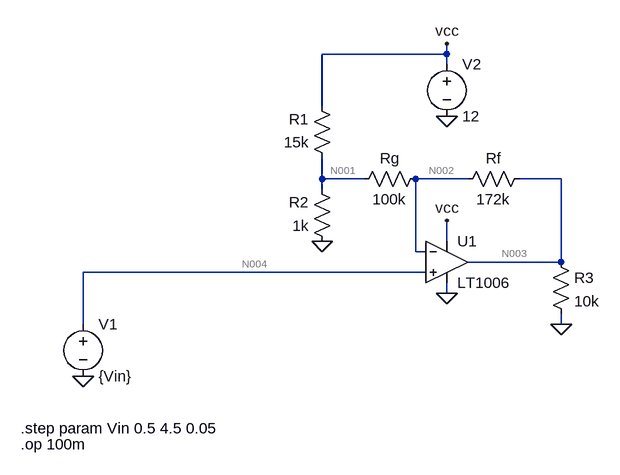
[diagram p0: schematic sim.asc]
sim.asc, the LTspice schematic file:
Version 4
SHEET 1 880 680
WIRE 592 -256 592 -272
WIRE 592 -256 400 -256
WIRE 592 -240 592 -256
WIRE 400 -176 400 -256
WIRE 400 -64 400 -96
WIRE 464 -64 400 -64
WIRE 624 -64 544 -64
WIRE 768 -64 704 -64
WIRE 400 -48 400 -64
WIRE 592 32 592 0
WIRE 544 48 544 -64
WIRE 560 48 544 48
WIRE 768 64 768 -64
WIRE 768 64 624 64
WIRE 560 80 32 80
WIRE 592 112 592 96
WIRE 32 160 32 80
WIRE 768 160 768 144
FLAG 592 -160 0
FLAG 32 240 0
FLAG 592 0 vcc
FLAG 592 112 0
FLAG 592 -272 vcc
FLAG 768 160 0
FLAG 400 32 0
SYMBOL voltage 32 144 R0
WINDOW 123 0 0 Left 2
WINDOW 39 0 0 Left 2
SYMATTR InstName V1
SYMATTR Value {Vin}
SYMBOL voltage 592 -256 R0
WINDOW 123 0 0 Left 2
WINDOW 39 0 0 Left 2
SYMATTR InstName V2
SYMATTR Value 12
SYMBOL res 720 -80 R90
WINDOW 0 0 56 VBottom 2
WINDOW 3 32 56 VTop 2
SYMATTR InstName Rf
SYMATTR Value 172k
SYMBOL res 560 -80 R90
WINDOW 0 0 56 VBottom 2
WINDOW 3 32 56 VTop 2
SYMATTR InstName Rg
SYMATTR Value 100k
SYMBOL res 416 48 R180
WINDOW 0 36 76 Left 2
WINDOW 3 36 40 Left 2
SYMATTR InstName R2
SYMATTR Value 1k
SYMBOL res 416 -80 R180
WINDOW 0 36 76 Left 2
WINDOW 3 36 40 Left 2
SYMATTR InstName R1
SYMATTR Value 15k
SYMBOL Opamps\\LT1006 592 0 R0
SYMATTR InstName U1
SYMBOL res 752 48 R0
SYMATTR InstName R3
SYMATTR Value 10k
TEXT -64 320 Left 2 !.step param Vin 0.5 4.5 0.05
TEXT -64 344 Left 2 !.op 100m

The netlist it stands for:
* sim.asc
V1 N004 0 {Vin}
V2 vcc 0 12
Rf N003 N002 172k
Rg N002 N001 100k
R2 0 N001 1k
R1 N001 vcc 15k
XU1 N004 N002 vcc 0 N003 LT1006  ; pins In+ In- V+ V- OUT
R3 N003 0 10k
.step param Vin 0.5 4.5 0.05
.op 100m
.lib LTC.lib
.backanno
.end

* Results of the author's LTspice run, read from the files saved beside the schematic
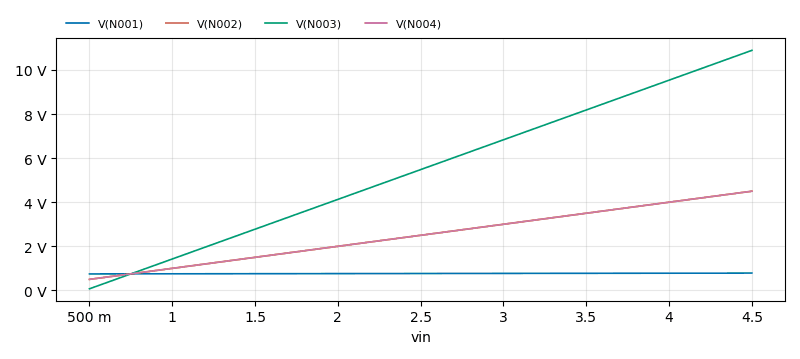
[diagram p1: Operating Point of sim.asc, plotted from the saved traces]
* Operating Point, 1 run:
*   V(N001): 747.7 mV at vin=500 m, 784.8 mV at vin=4.5 , min 747.7 mV, max 784.8 mV
*   V(N002): 500 mV at vin=500 m, 4.5 V at vin=4.5 , min 500 mV, max 4.5 V
*   V(N003): 72.39 mV at vin=500 m, 10.89 V at vin=4.5 , min 72.39 mV, max 10.89 V
*   V(N004): 500 mV at vin=500 m, 4.5 V at vin=4.5 , min 500 mV, max 4.5 V
* From the log:
*   Semiconductor Device Operating Points:
*                           --- Diodes ---
*   Name:    d:u1:6      d:u1:1      d:u1:5      d:u1:4      d:u1:3
*   Model:    u1:yd       u1:yu       u1:xd       u1:xu     u1:dbias
*   Id:      1.10e-14   -1.10e-14   -1.41e-12   -2.51e-10   -8.81e-09
*   Vd:      5.48e-03   -5.48e-03   -6.69e-02   -1.19e+01   -1.15e+01
*   Req:     1.00e-12    1.00e-12    2.00e-11    2.00e-11    1.00e+12
*   CAP:     0.00e+00    0.00e+00    0.00e+00    0.00e+00    0.00e+00
*   Name:    d:u1:2
*   Model:  u1:dbias
*   Id:     -8.81e-09
*   Vd:     -1.15e+01
*   Req:     1.00e+12
*   CAP:     0.00e+00
*                           --- VDMOSFET Transistors ---
*   Name:        m:u1:2      m:u1:1
*   Model:        u1:p        u1:n
*   Id:         -3.23e-04    3.28e-04
*   Vgs:        -5.48e-03   -5.48e-03
*   Vds:        -7.24e-02    1.19e+01
*   Vth:         1.20e-01   -1.20e-01
*   Gm:          3.62e-03    5.73e-03
*   Gds:         2.65e-03    0.00e+00
*   Cgs:         0.00e+00    0.00e+00
*   Cgd:         0.00e+00    0.00e+00
*   Cbody:       0.00e+00    0.00e+00